# EAGLE design FIFO+Expander-v3-Rev1 (EAGLE 9.6.2)

## Sheet 1 of 3
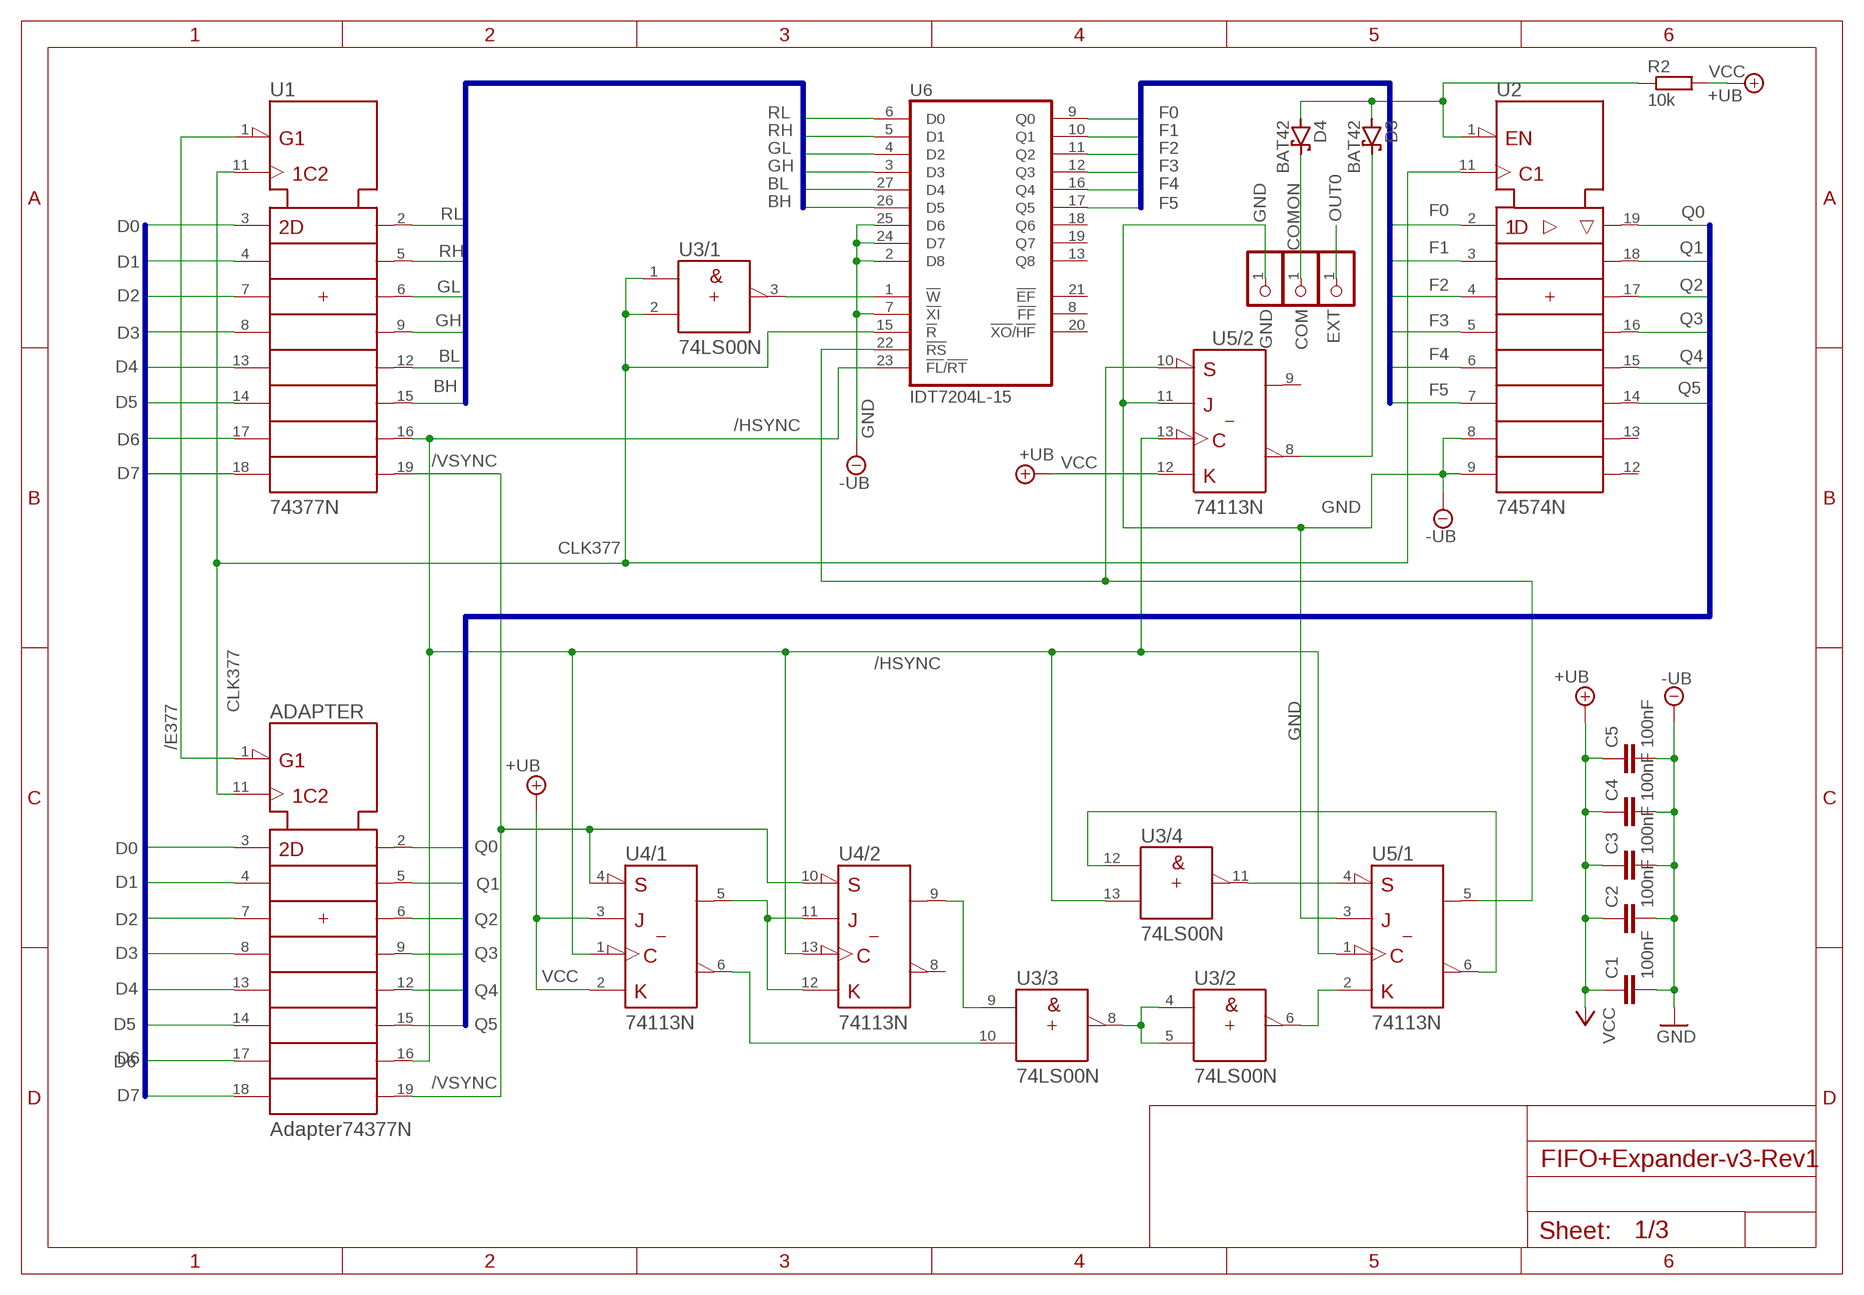
[diagram p0: schematic, sheet 1]

### Parts
ADAPTER  Adapter74377N  74377N  [DIL20]
C1  100nF  C5/2.5  [C5B2.5]
C2  100nF  C5/2.5  [C5B2.5]
C3  100nF  C5/2.5  [C5B2.5]
C4  100nF  C5/2.5  [C5B2.5]
C5  100nF  C5/2.5  [C5B2.5]
COMON  COM  PINHD-1X1  [1X01]
D3  BAT42  [DO35-10]
D4  BAT42  [DO35-10]
GND  GND  PINHD-1X1  [1X01]
OUT0  EXT  PINHD-1X1  [1X01]
R2  10k  R-EU_0207/10  [0207/10]
U1  74377N  [DIL20]
U2  74574N  [DIL20]
U3  74LS00N  [DIL14]
U4  74113N  [DIL14]
U5  74113N  [DIL14]
U6  IDT7204L-15  7203PDIL28-3  [DIL28-3]

### Nets
/E377: ADAPTER.1(!G) U1.1(!G)
/HSYNC: ADAPTER.16(7Q) U1.16(7Q) U3.13(/4:B) U4.1(/1:CLK) U4.13(/2:CLK) U5.1(/1:CLK) U5.13(/2:CLK) U6.23(!FL!/!RT)
/VSYNC: ADAPTER.19(8Q) U1.19(8Q) U4.4(/1:!PRE) U4.10(/2:!PRE)
BH: U1.15(6Q) U6.26(D5)
BL: U1.12(5Q) U6.27(D4)
CLK377: ADAPTER.11(CLK) U1.11(CLK) U2.11(CLK) U3.1(/1:A) U3.2(/1:B) U6.15(!R)
D0: ADAPTER.3(1D) U1.3(1D)
D1: ADAPTER.4(2D) U1.4(2D)
D2: ADAPTER.7(3D) U1.7(3D)
D3: ADAPTER.8(4D) U1.8(4D)
D4: ADAPTER.13(5D) U1.13(5D)
D5: ADAPTER.14(6D) U1.14(6D)
D6: ADAPTER.17(7D) U1.17(7D)
D7: ADAPTER.18(8D) U1.18(8D)
F0: U2.2(1D) U6.9(Q0)
F1: U2.3(2D) U6.10(Q1)
F2: U2.4(3D) U6.11(Q2)
F3: U2.5(4D) U6.12(Q3)
F4: U2.6(5D) U6.16(Q4)
F5: U2.7(6D) U6.17(Q5)
GH: U1.9(4Q) U6.3(D3)
GL: U1.6(3Q) U6.4(D2)
GND [power]: C1.2 C2.2 C3.2 C4.2 C5.2 GND.1 U2.8(7D) U2.9(8D) U5.3(/1:J) U5.11(/2:J) U6.2(D8) U6.7(!XI) U6.24(D7) U6.25(D6) ; supply symbol labelled -UB ; also sheet 2,3
N$1: U4.5(/1:Q) U4.11(/2:J) U4.12(/2:K)
N$2: U3.3(/1:Y) U6.1(!W)
N$3: U3.10(/3:B) U4.6(/1:!Q)
N$4: U3.9(/3:A) U4.9(/2:Q)
N$5: D3.A D4.A R2.1 U2.1(!OC)
N$6: U3.4(/2:A) U3.5(/2:B) U3.8(/3:Y)
N$7: U3.6(/2:Y) U5.2(/1:K)
N$8: U3.11(/4:Y) U5.4(/1:!PRE)
N$9: U3.12(/4:A) U5.6(/1:!Q)
N$10: COMON.1 D4.C
N$11: D3.C U5.8(/2:!Q)
N$12: U5.5(/1:Q) U5.10(/2:!PRE) U6.22(!RS)
OUT0: OUT0.1 ; also sheet 3
Q0: ADAPTER.2(1Q) U2.19(1Q)
Q1: ADAPTER.5(2Q) U2.18(2Q)
Q2: ADAPTER.6(3Q) U2.17(3Q)
Q3: ADAPTER.9(4Q) U2.16(4Q)
Q4: ADAPTER.12(5Q) U2.15(5Q)
Q5: ADAPTER.15(6Q) U2.14(6Q)
RH: U1.5(2Q) U6.5(D1)
RL: U1.2(1Q) U6.6(D0)
VCC [power]: C1.1 C2.1 C3.1 C4.1 C5.1 R2.2 U4.2(/1:K) U4.3(/1:J) U5.12(/2:K) ; supply symbol labelled +UB ; also sheet 2,3
Unconnected: U2.12(8Q) U2.13(7Q) U4.8(/2:!Q) U5.9(/2:Q) U6.8(!FF) U6.13(Q8) U6.18(Q6) U6.19(Q7) U6.20(!XO!/!HF) U6.21(!EF)

### Buses
D0,D1,D2,D3,D4,D5,D6,D7
BH,BL,GH,GL,RH,RL
F0,F1,F2,F3,F4,F5
Q0,Q1,Q2,Q3,Q4,Q5

## Sheet 2 of 3
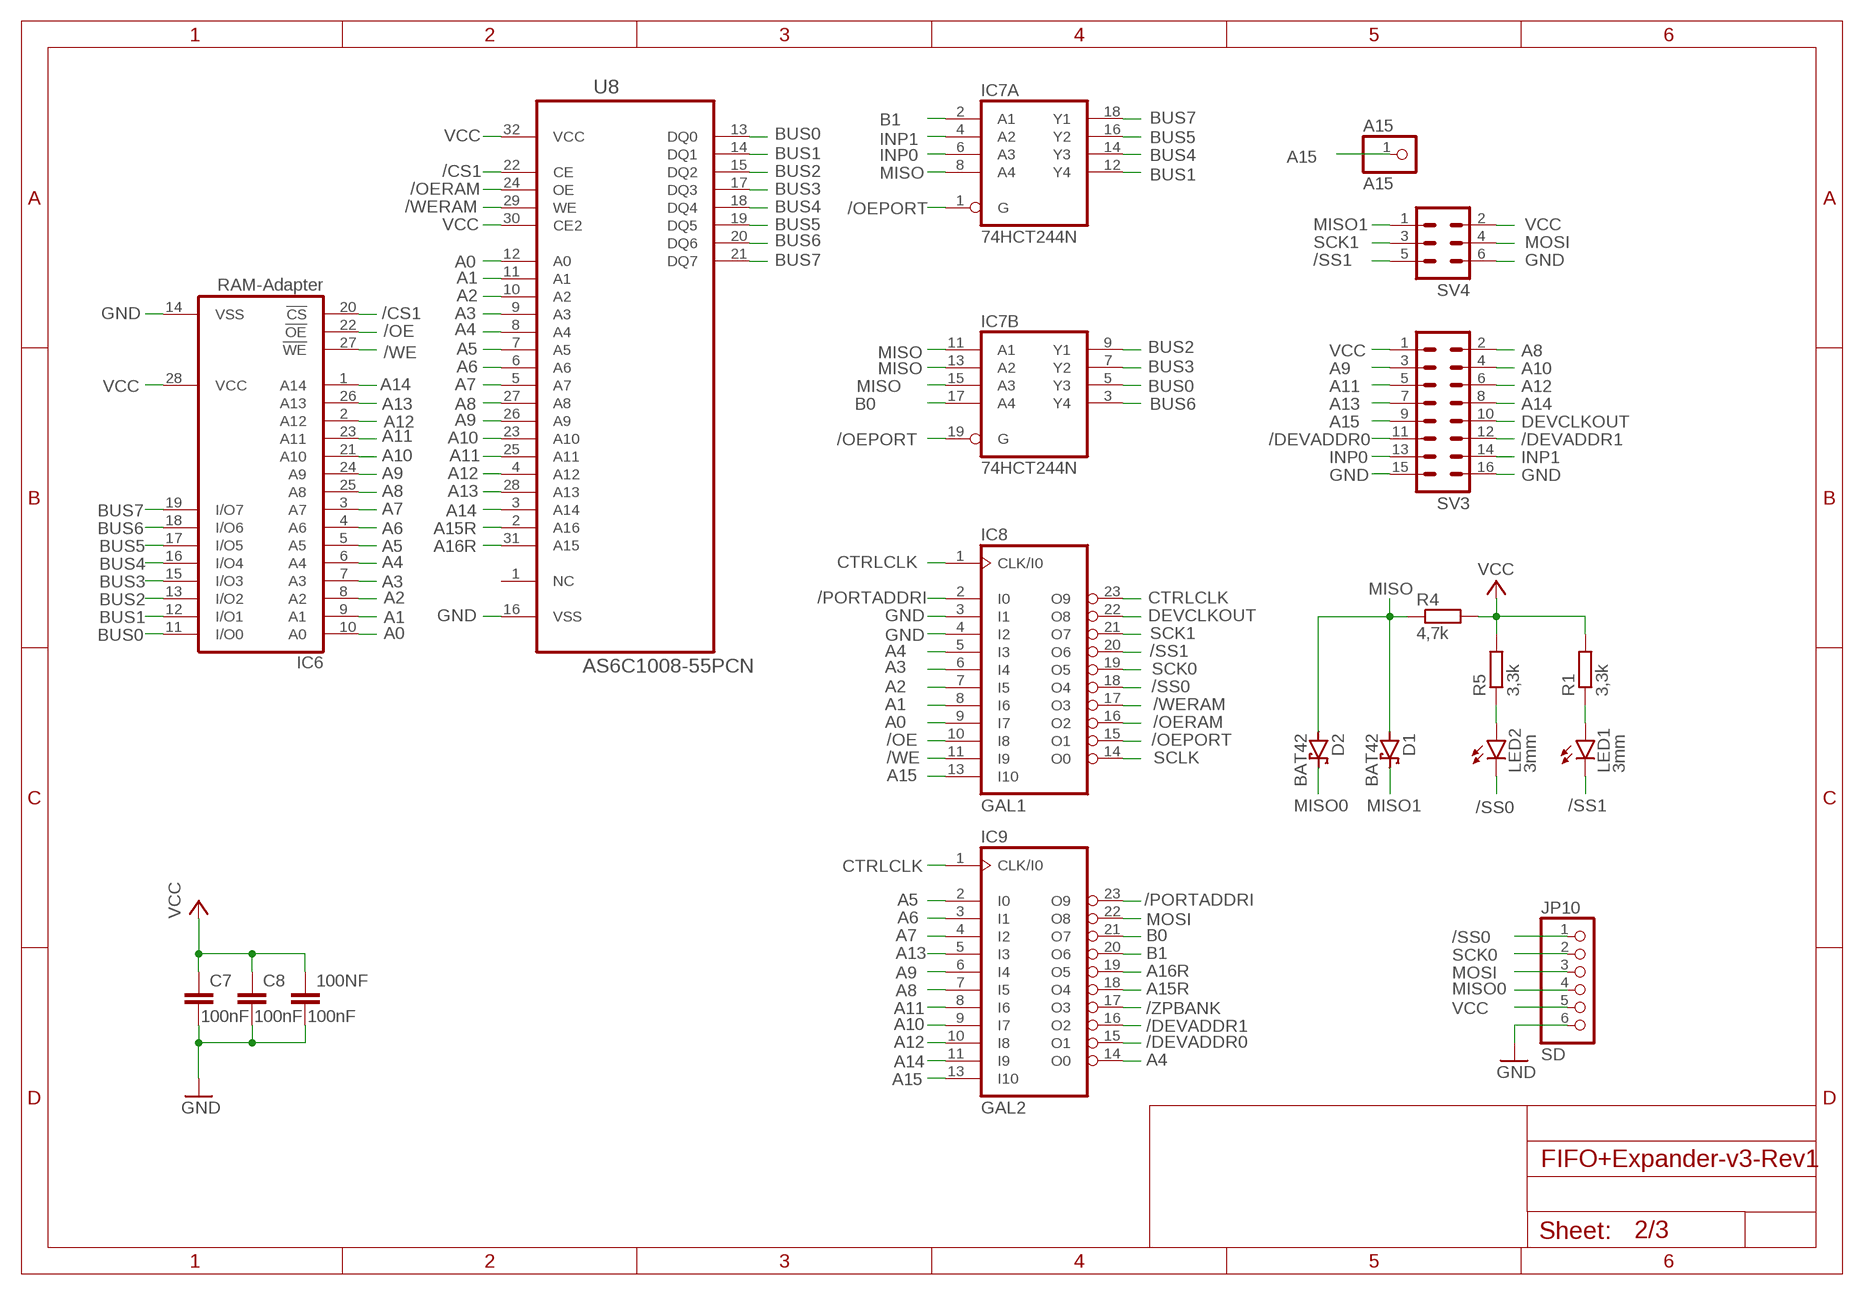
[diagram p1: schematic, sheet 2]

### Parts
100NF  100nF  C5/2.5  [C5B2.5]
A15  A15  PINHD-1X1  [1X01]
C7  100nF  C5/2.5  [C5B2.5]
C8  100nF  C5/2.5  [C5B2.5]
D1  BAT42  [DO35-10]
D2  BAT42  [DO35-10]
IC6  RAM-Adapter  62256P  [DIL28-6]
IC7  74HCT244N  [DIL20]
IC8  GAL1  22V10  [DIL24-3]
IC9  GAL2  22V10  [DIL24-3]
JP10  SD  PINHD-1X6  [1X06]
LED1  3mm  LED3MM  [LED3MM]
LED2  3mm  LED3MM  [LED3MM]
R1  3,3k  R-EU_0207/10  [0207/10]
R4  4,7k  R-EU_0207/10  [0207/10]
R5  3,3k  R-EU_0207/10  [0207/10]
SV3  ML16  [ML16]
SV4  ML6  [ML6]
U8  AS6C1008-55PCN  [DIP254P1524X393-32]

### Nets
/CS1: IC6.20(!CS) U8.22(CE)
/DEVADDR0: IC9.15(O1) SV3.11 ; also sheet 3
/DEVADDR1: IC9.16(O2) SV3.12
/OE: IC6.22(!OE) IC8.10(I8)
/OEPORT: IC7.1(A:G) IC7.19(B:G) IC8.15(O1)
/OERAM: IC8.16(O2) U8.24(OE)
/PORTADDRI: IC8.2(I0) IC9.23(O9)
/SS0: IC8.18(O4) JP10.1 LED2.K(C)
/SS1: IC8.20(O6) LED1.K(C) SV4.5
/WE: IC6.27(!WE) IC8.11(I9)
/WERAM: IC8.17(O3) U8.29(WE)
/ZPBANK: IC9.17(O3)
A0: IC6.10(A0) IC8.9(I7) U8.12(A0)
A1: IC6.9(A1) IC8.8(I6) U8.11(A1)
A2: IC6.8(A2) IC8.7(I5) U8.10(A2)
A3: IC6.7(A3) IC8.6(I4) U8.9(A3)
A4: IC6.6(A4) IC8.5(I3) IC9.14(O0) U8.8(A4)
A5: IC6.5(A5) IC9.2(I0) U8.7(A5)
A6: IC6.4(A6) IC9.3(I1) U8.6(A6)
A7: IC6.3(A7) IC9.4(I2) U8.5(A7)
A8: IC6.25(A8) IC9.7(I5) SV3.2 U8.27(A8) ; also sheet 3
A9: IC6.24(A9) IC9.6(I4) SV3.3 U8.26(A9) ; also sheet 3
A10: IC6.21(A10) IC9.9(I7) SV3.4 U8.23(A10) ; also sheet 3
A11: IC6.23(A11) IC9.8(I6) SV3.5 U8.25(A11) ; also sheet 3
A12: IC6.2(A12) IC9.10(I8) SV3.6 U8.4(A12) ; also sheet 3
A13: IC6.26(A13) IC9.5(I3) SV3.7 U8.28(A13) ; also sheet 3
A14: IC6.1(A14) IC9.11(I9) SV3.8 U8.3(A14) ; also sheet 3
A15: A15.1 IC8.13(I10) IC9.13(I10) SV3.9 ; also sheet 3
A15R: IC9.18(O4) U8.2(A16)
A16R: IC9.19(O5) U8.31(A15)
B0: IC7.17(B:A4) IC9.21(O7)
B1: IC7.2(A:A1) IC9.20(O6)
BUS0: IC6.11(I/O0) IC7.5(B:Y3) U8.13(DQ0)
BUS1: IC6.12(I/O1) IC7.12(A:Y4) U8.14(DQ1)
BUS2: IC6.13(I/O2) IC7.9(B:Y1) U8.15(DQ2)
BUS3: IC6.15(I/O3) IC7.7(B:Y2) U8.17(DQ3)
BUS4: IC6.16(I/O4) IC7.14(A:Y3) U8.18(DQ4)
BUS5: IC6.17(I/O5) IC7.16(A:Y2) U8.19(DQ5)
BUS6: IC6.18(I/O6) IC7.3(B:Y4) U8.20(DQ6)
BUS7: IC6.19(I/O7) IC7.18(A:Y1) U8.21(DQ7)
CTRLCLK: IC8.1(CLK/I0) IC8.23(O9) IC9.1(CLK/I0)
DEVCLKOUT: IC8.22(O8) SV3.10 ; also sheet 3
GND [power]: 100NF.2 C7.2 C8.2 IC6.14(VSS) IC8.3(I1) IC8.4(I2) JP10.6 SV3.15 SV3.16 SV4.6 U8.16(VSS) ; also sheet 1,3
INP0 [power]: IC7.6(A:A3) SV3.13
INP1 [power]: IC7.4(A:A2) SV3.14
MISO [power]: D1.A D2.A IC7.8(A:A4) IC7.11(B:A1) IC7.13(B:A2) IC7.15(B:A3) R4.1
MISO0: D2.C JP10.4
MISO1: D1.C SV4.1
MOSI: IC9.22(O8) JP10.3 SV4.4
N$13: LED2.A R5.1
N$14: LED1.A R1.1
SCK0: IC8.19(O5) JP10.2
SCK1: IC8.21(O7) SV4.3
SCLK: IC8.14(O0)
VCC [power]: 100NF.1 C7.1 C8.1 IC6.28(VCC) JP10.5 R1.2 R4.2 R5.2 SV3.1 SV4.2 U8.30(CE2) U8.32(VCC) ; also sheet 1,3
Unconnected: U8.1(NC)

## Sheet 3 of 3
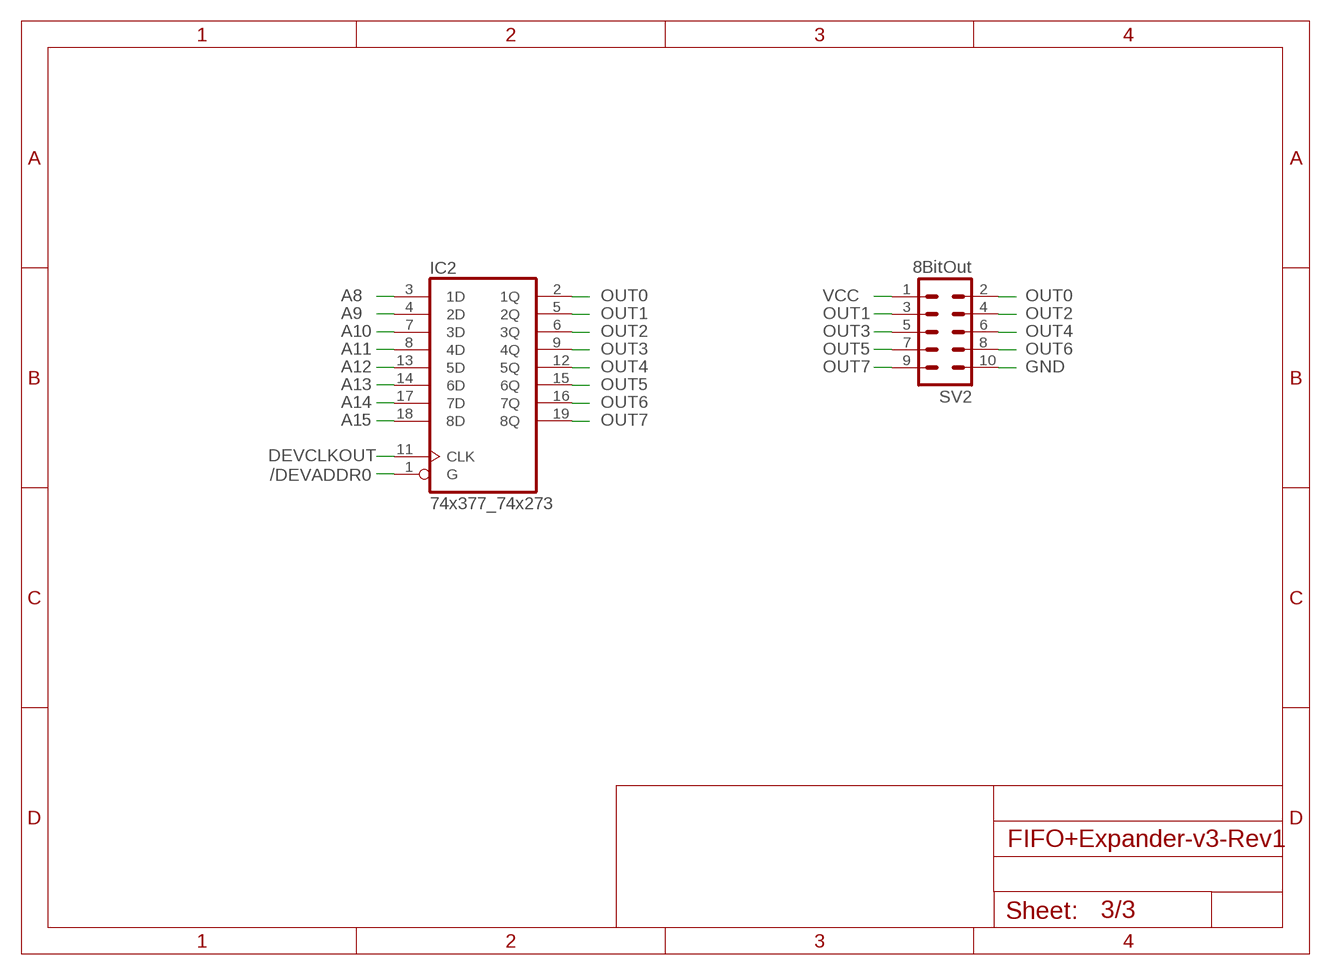
[diagram p2: schematic, sheet 3]

### Parts
IC2  74x377_74x273  74AC377N  [DIL20]
SV2  8BitOut  ML10  [ML10]

### Nets
/DEVADDR0: IC2.1(G) ; also sheet 2
A8: IC2.3(1D) ; also sheet 2
A9: IC2.4(2D) ; also sheet 2
A10: IC2.7(3D) ; also sheet 2
A11: IC2.8(4D) ; also sheet 2
A12: IC2.13(5D) ; also sheet 2
A13: IC2.14(6D) ; also sheet 2
A14: IC2.17(7D) ; also sheet 2
A15: IC2.18(8D) ; also sheet 2
DEVCLKOUT: IC2.11(CLK) ; also sheet 2
GND [power]: SV2.10 ; also sheet 1,2
OUT0: IC2.2(1Q) SV2.2 ; also sheet 1
OUT1: IC2.5(2Q) SV2.3
OUT2: IC2.6(3Q) SV2.4
OUT3: IC2.9(4Q) SV2.5
OUT4: IC2.12(5Q) SV2.6
OUT5: IC2.15(6Q) SV2.7
OUT6: IC2.16(7Q) SV2.8
OUT7: IC2.19(8Q) SV2.9
VCC [power]: SV2.1 ; also sheet 1,2

## Power pins joined to a net without a drawn wire
GND: ADAPTER.10(-UB) IC2.10(GND) IC7.10(P:GND) IC8.12(GND) IC9.12(GND) U1.10(-UB) U2.10(-UB) U3.7(/-UB:-UB) U4.7(/-UB:-UB) U5.7(/-UB:-UB) U6.14(GND)
VCC: ADAPTER.20(+UB) IC2.20(VCC) IC7.20(P:VCC) IC8.24(VCC) IC9.24(VCC) U1.20(+UB) U2.20(+UB) U3.14(/+UB:+UB) U4.14(/+UB:+UB) U5.14(/+UB:+UB) U6.28(VCC)

## Library data of the parts
100NF C1-C5 C7 C8 = capacitor-wima:C: CAPACITOR naming: grid - package width
A15 COMON GND OUT0 = pinhead:PINHD-1X1: PIN HEADER
ADAPTER U1 = 74ttl-din:74*377: Octal D type FLIP FLOP, enable
D1-D4 = diode:BAT42: DIODE barrier diode
IC2 = 74xx-eu:74*377: Octal D type FLIP FLOP, enable
IC6 = memory-hitachi:62256P: MEMORY; OC_FARNELL: unknown; OC_NEWARK: unknown
IC7 = 74xx-eu:74*244: Octal BUFFER and LINE DRIVER, 3-state
IC8 IC9 = pal:22V10: PAL; MPN: GAL22V10D-7LPN; OC_FARNELL: 1571925; OC_NEWARK: 97M0480
JP10 = pinhead:PINHD-1X6: PIN HEADER
LED1 LED2 = led:LED: LED OSRAM: - CHIPLED LG R971, LG N971, LY N971, LG Q971, LY Q971, LO R971, LY R971 LH N974, LH R974 LS Q976, LO Q976, LY Q976 LO Q996 - Hyper CHIPLED LW Q18S LB Q993, LB Q99A, LB R99A - SideLED LS A670, LO A670, LY A670, LG A670, LP A670 LB A673, LV A673, LT A673, LW A673 LH A674 LY A675 LS A676, LA A676, LO A676, LY A676, LW A676 LS A679, LY A679, LG A679 - Hyper Micro SIDELED® LS Y876, LA Y876, LO Y876, LY Y876 LT Y87S - SmartLED LW L88C, LW L88S LB L89C, LB L89S, LG L890 LS L89K, LO L89K, LY L89K LS L896, LA L896, LO L896, LY L896 - TOPLED LS T670, LO T670, LY T670, LG T670, LP T670 LSG T670, LSP T670, LSY T670, LOP T670, LYG T670 LG T671, LOG T671, LSG T671 LB T673, LV T673, LT T673, LW T673 LH T674 LS T676, LA T676, LO T676, LY T676, LB T676, LH T676, LSB T676, LW T676 LB T67C, LV T67C, LT T67C, LS T67K, LO T67K, LY T67K, LW E67C LS E67B, LA E67B, LO E67B, LY E67B, LB E67C, LV E67C, LT E67C LW T67C LS T679, LY T679, LG T679 LS T770, LO T770, LY T770, LG T770, LP T770 LB T773, LV T773, LT T773, LW T773 LH T774 LS E675, LA E675, LY E675, LS T675 LS T776, LA T776, LO T776, LY T776, LB T776 LHGB T686 LT T68C, LB T68C - Hyper Mini TOPLED® LB M676 - Mini TOPLED Santana® LG M470 LS M47K, LO M47K, LY M47K Source: http://www.osram.convergy.de LUXEON: - LUMILED® LXK2-PW12-R00, LXK2-PW12-S00, LXK2-PW14-U00, LXK2-PW14-V00 LXK2-PM12-R00, LXK2-PM12-S00, LXK2-PM14-U00 LXK2-PE12-Q00, LXK2-PE12-R00, LXK2-PE12-S00, LXK2-PE14-T00, LXK2-PE14-U00 LXK2-PB12-K00, LXK2-PB12-L00, LXK2-PB12-M00, LXK2-PB14-N00, LXK2-PB14-P00, LXK2-PB14-Q00 LXK2-PR12-L00, LXK2-PR12-M00, LXK2-PR14-Q00, LXK2-PR14-R00 LXK2-PD12-Q00, LXK2-PD12-R00, LXK2-PD12-S00 LXK2-PH12-R00, LXK2-PH12-S00 LXK2-PL12-P00, LXK2-PL12-Q00, LXK2-PL12-R00 Source: www.luxeon.com KINGBRIGHT: KA-3528ASYC Source: www.kingbright.com
R1 R2 R4 R5 = rcl:R-EU_: RESISTOR, European symbol; SPICEPREFIX: R
SV2 = con-ml:ML10: HARTING; OC_FARNELL: unknown; OC_NEWARK: unknown
SV3 = con-ml:ML16: HARTING; OC_FARNELL: unknown; OC_NEWARK: unknown
SV4 = con-ml:ML6: HARTING; OC_FARNELL: unknown; OC_NEWARK: unknown
U2 = 74ttl-din:74*574: 8-bit D type FLIP FLOP bus driver
U3 = 74ttl-din:74*00: Quad 2-input NAND gate
U4 U5 = 74ttl-din:74*113: Dual J-K negative edge triggered FLIP FLOP, preset
U6 = memory-idt:7203P: MEMORY
U8 = Alliance_Memory_By_element14_Batch_1:AS6C1008-55PCN: CMOS SRAM; MPN: AS6C1008-55PCN; OC_FARNELL: 1562896; OC_NEWARK: 94M6214; PACKAGE: DIP-32; SUPPLIER: ALLIANCE MEMORY

## Net classes
0 default: width 0.152 mm, drill 0.127 mm, clearance 0.127 mm
1 power: width 0.203 mm, drill 0.127 mm, clearance 0.127 mm

## Board
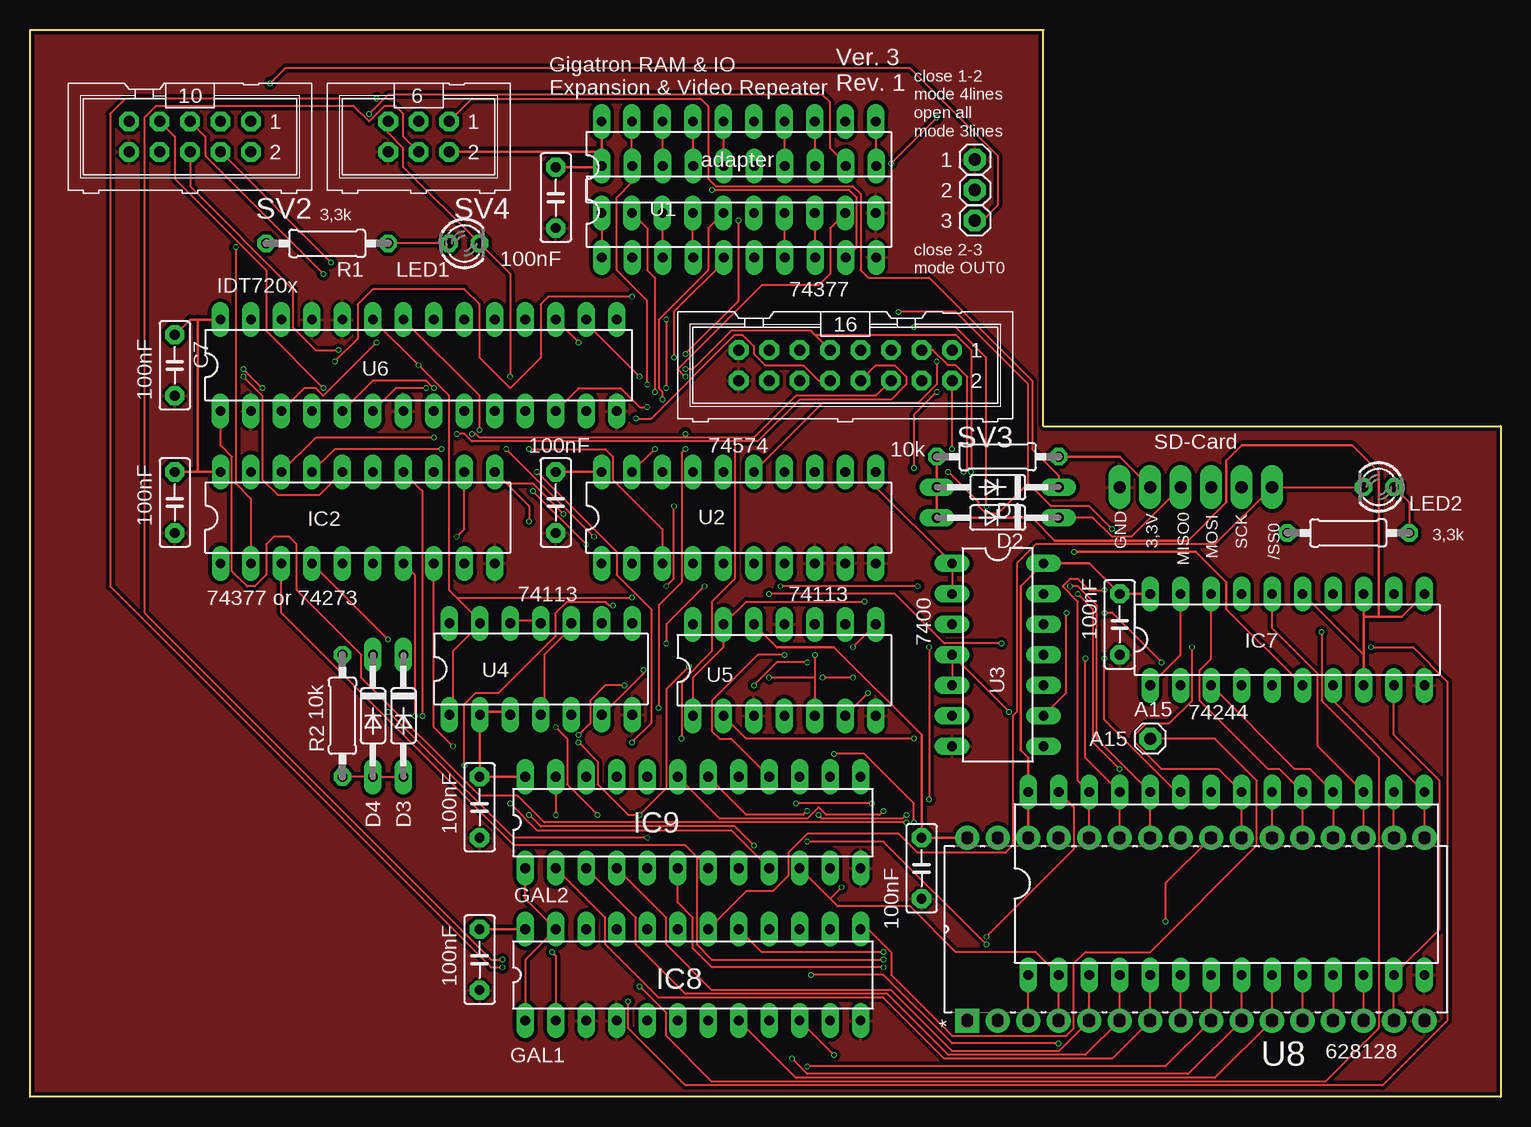
[diagram p3: board, top side]
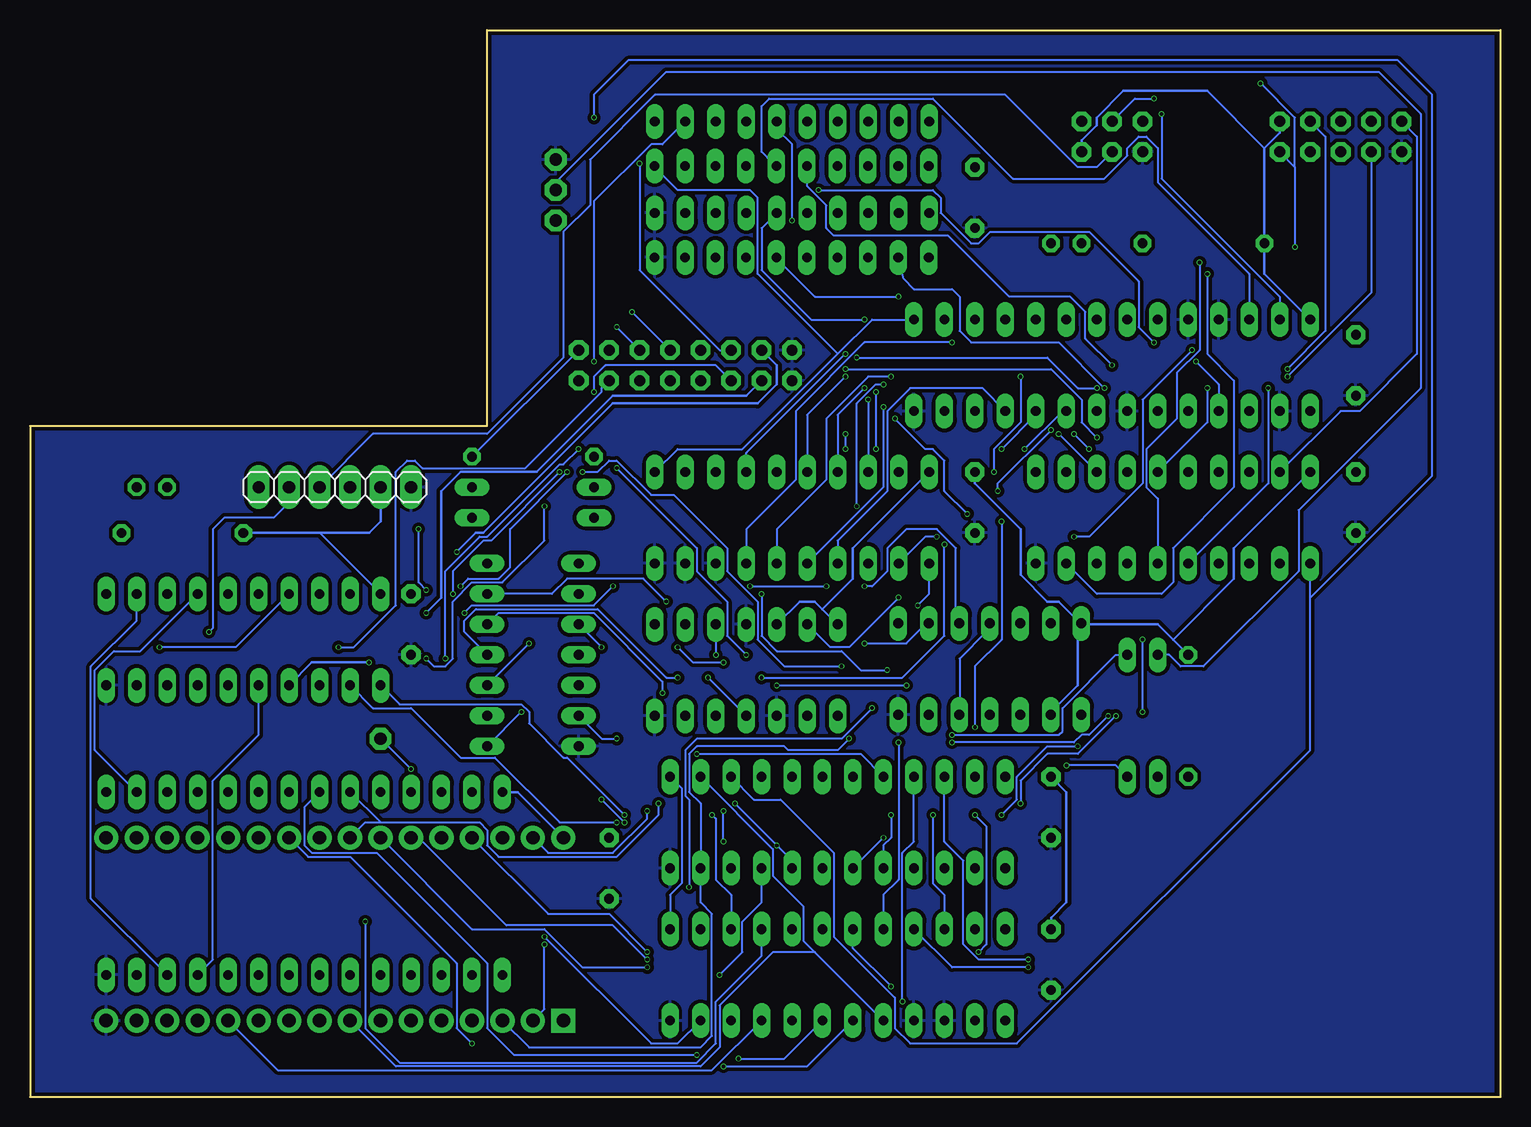
[diagram p4: board, bottom side, seen from below]

Size 122.56 x 88.9 mm. Coordinates in mm from the lower left corner, seen from the top.
Outline: 84.45,55.88 122.56,55.88 122.56,0 0,0 0,88.9 84.45,88.9 84.45,55.88
Copper layers (1*16): Top 0.035mm / dielectric 1.6mm / Bottom 0.035mm
Design rules "jlcpcb-2layers": minimum track width 5mil, minimum drill 0.3mm, track to track 5mil, track to pad 5mil, pad to pad 5mil, via to via 5mil, smd to smd 5mil, copper to edge 0.2mm, drill to drill 6mil, minimum pad ring 10mil, minimum via ring 3mil, stop-mask expansion 4mil, vias tented up to drill 0mil, thermal gap 10mil

### Footprints (pad centres in the part's own frame; a part is rotated, then mirrored left to right if it is on the bottom)
C5B2.5 = drill 0.813 pad 1.6 octagon: 1 -2.54,0; 2 2.54,0
1X01 = drill 1.016 octagon: 1 0,0
DIL20 = drill 0.813 long: 1 -11.43,-3.81; 2 -8.89,-3.81; 3 -6.35,-3.81; 4 -3.81,-3.81; 5 -1.27,-3.81; 6 1.27,-3.81; 7 3.81,-3.81; 8 6.35,-3.81; 9 8.89,-3.81; 10 11.43,-3.81; 11 11.43,3.81; 12 8.89,3.81; 13 6.35,3.81; 14 3.81,3.81; 15 1.27,3.81; 16 -1.27,3.81; 17 -3.81,3.81; 18 -6.35,3.81; 19 -8.89,3.81; 20 -11.43,3.81
DO35-10 = drill 0.813 long: A 5.08,0; C -5.08,0
DIL28-6 = drill 0.813 long: 1 -16.51,-7.62; 2 -13.97,-7.62; 3 -11.43,-7.62; 4 -8.89,-7.62; 5 -6.35,-7.62; 6 -3.81,-7.62; 7 -1.27,-7.62; 8 1.27,-7.62; 9 3.81,-7.62; 10 6.35,-7.62; 11 8.89,-7.62; 12 11.43,-7.62; 13 13.97,-7.62; 14 16.51,-7.62; 15 16.51,7.62; 16 13.97,7.62; 17 11.43,7.62; 18 8.89,7.62; 19 6.35,7.62; 20 3.81,7.62; 21 1.27,7.62; 22 -1.27,7.62; 23 -3.81,7.62; 24 -6.35,7.62; 25 -8.89,7.62; 26 -11.43,7.62; 27 -13.97,7.62; 28 -16.51,7.62
DIL24-3 = drill 0.813 long: 1 -13.97,-3.81; 2 -11.43,-3.81; 3 -8.89,-3.81; 4 -6.35,-3.81; 5 -3.81,-3.81; 6 -1.27,-3.81; 7 1.27,-3.81; 8 3.81,-3.81; 9 6.35,-3.81; 10 8.89,-3.81; 11 11.43,-3.81; 12 13.97,-3.81; 13 13.97,3.81; 14 11.43,3.81; 15 8.89,3.81; 16 6.35,3.81; 17 3.81,3.81; 18 1.27,3.81; 19 -1.27,3.81; 20 -3.81,3.81; 21 -6.35,3.81; 22 -8.89,3.81; 23 -11.43,3.81; 24 -13.97,3.81
1X06 = drill 1.016 long: 1 -6.35,0; 2 -3.81,0; 3 -1.27,0; 4 1.27,0; 5 3.81,0; 6 6.35,0
LED3MM = drill 0.813 octagon: A -1.27,0; K 1.27,0
0207/10 = drill 0.813 octagon: 1 -5.08,0; 2 5.08,0
ML10 = drill 0.914 octagon: 1 -5.08,-1.27; 2 -5.08,1.27; 3 -2.54,-1.27; 4 -2.54,1.27; 5 0,-1.27; 6 0,1.27; 7 2.54,-1.27; 8 2.54,1.27; 9 5.08,-1.27; 10 5.08,1.27
ML16 = drill 0.914 octagon: 1 -8.89,-1.27; 2 -8.89,1.27; 3 -6.35,-1.27; 4 -6.35,1.27; 5 -3.81,-1.27; 6 -3.81,1.27; 7 -1.27,-1.27; 8 -1.27,1.27; 9 1.27,-1.27; 10 1.27,1.27; 11 3.81,-1.27; 12 3.81,1.27; 13 6.35,-1.27; 14 6.35,1.27; 15 8.89,-1.27; 16 8.89,1.27
ML6 = drill 0.914 octagon: 1 -2.54,-1.27; 2 -2.54,1.27; 3 0,-1.27; 4 0,1.27; 5 2.54,-1.27; 6 2.54,1.27
DIL14 = drill 0.813 long: 1 -7.62,-3.81; 2 -5.08,-3.81; 3 -2.54,-3.81; 4 0,-3.81; 5 2.54,-3.81; 6 5.08,-3.81; 7 7.62,-3.81; 8 7.62,3.81; 9 5.08,3.81; 10 2.54,3.81; 11 0,3.81; 12 -2.54,3.81; 13 -5.08,3.81; 14 -7.62,3.81
DIL28-3 = drill 0.813 long: 1 -16.51,-3.81; 2 -13.97,-3.81; 3 -11.43,-3.81; 4 -8.89,-3.81; 5 -6.35,-3.81; 6 -3.81,-3.81; 7 -1.27,-3.81; 8 1.27,-3.81; 9 3.81,-3.81; 10 6.35,-3.81; 11 8.89,-3.81; 12 11.43,-3.81; 13 13.97,-3.81; 14 16.51,-3.81; 15 16.51,3.81; 16 13.97,3.81; 17 11.43,3.81; 18 8.89,3.81; 19 6.35,3.81; 20 3.81,3.81; 21 1.27,3.81; 22 -1.27,3.81; 23 -3.81,3.81; 24 -6.35,3.81; 25 -8.89,3.81; 26 -11.43,3.81; 27 -13.97,3.81; 28 -16.51,3.81
DIP254P1524X393-32 = drill 1.118 square: 1 -15.24,38.1 | drill 1.118: 2 -15.24,35.56; 3 -15.24,33.02; 4 -15.24,30.48; 5 -15.24,27.94; 6 -15.24,25.4; 7 -15.24,22.86; 8 -15.24,20.32; 9 -15.24,17.78; 10 -15.24,15.24; 11 -15.24,12.7; 12 -15.24,10.16; 13 -15.24,7.62; 14 -15.24,5.08; 15 -15.24,2.54; 16 -15.24,0; 17 0,0; 18 0,2.54; 19 0,5.08; 20 0,7.62; 21 0,10.16; 22 0,12.7; 23 0,15.24; 24 0,17.78; 25 0,20.32; 26 0,22.86; 27 0,25.4; 28 0,27.94; 29 0,30.48; 30 0,33.02; 31 0,35.56; 32 0,38.1

### Placement (x,y rotation side)
100NF  37.46,11.43 270 top
A15  93.34,29.84 0 top
ADAPTER  59.06,77.47 0 top
C1  43.81,49.53 270 top
C2  12.06,49.53 270 top
C3  90.81,39.37 270 top
C4  74.29,19.05 270 top
C5  43.81,74.93 270 top
C7  12.06,60.96 270 top
C8  37.46,24.13 270 top
COMON  78.74,75.56 0 top
D1  80.64,50.8 180 top
D2  80.64,48.26 180 top
D3  31.11,31.75 270 top
D4  28.57,31.75 270 top
GND  78.74,78.1 0 top
IC2  27.3,48.26 0 top
IC6  99.69,17.78 0 top
IC7  104.78,38.1 0 top
IC8  55.25,10.16 0 top
IC9  55.25,22.86 0 top
JP10  97.16,50.8 0 bottom
LED1  36.19,71.12 0 top
LED2  112.39,50.8 180 top
OUT0  78.74,73.02 0 top
R1  24.77,71.12 180 top
R2  26.03,31.75 90 top
R4  80.64,53.34 0 top
R5  109.85,46.99 180 top
SV2  13.33,80.01 180 top
SV3  67.94,60.96 180 top
SV4  32.38,80.01 180 top
U1  59.08,73.76 0 top
U2  59.06,48.26 0 top
U3  80.64,36.83 270 top
U4  42.57,35.65 0 top
U5  62.86,35.56 0 top
U6  32.38,60.96 0 top
U8  116.2,21.59 90 top

### Tracks (layer width: path | path; a pad name or v marks a point on that pad's centre or on a via)
/CS1
  Top 0.152: U8.22 IC6.20
/DEVADDR0  (via drill 0.3)
  Top 0.152: v75.56,81.6 v71.75,77.79
  Bottom 0.152: 15.88,41.59 15.88,28.89 40.32,4.44 49.21,4.44 50.48,5.71 50.48,8.25 55.56,13.33 55.56,20.32 60.01,24.77 62.23,24.77 IC9.15 | 15.88,41.59 IC2.1 | SV3.11 65.09,62.23 71.75,68.9 v71.75,77.79 | v75.56,81.6 75.56,83.5 72.71,86.36 8.57,86.36 5.71,83.5 5.71,51.75 15.88,41.59
/DEVADDR1  (via drill 0.3)
  Top 0.152: IC9.16 58.42,29.84 57.47,29.84 56.83,30.48 56.83,33.02 60.64,36.83 v62.86,36.83 | v73.66,52.39 73.66,56.83 v75.56,58.74
  Bottom 0.152: v62.86,36.83 64.45,38.42 64.45,41.27 66.99,43.81 66.99,45.72 v73.66,52.39 | v75.56,58.74 75.56,60.01 74.61,60.96 65.41,60.96 SV3.12
/E377
  Top 0.152: ADAPTER.1 47.62,70.17 U1.1
/HSYNC  (via drill 0.3)
  Top 0.152: U5.1 55.25,34.92 57.78,37.47 U5.13 59.69,41.27 v69.53,41.27 | ADAPTER.16 57.78,77.79 U1.16 | U4.1 35.24,32.07 35.24,37.15 37.46,39.37 U4.13 37.46,39.69 35.56,41.59 | U6.23 v32.38,60.96 34.92,58.42 34.92,42.23 35.56,41.59 | 35.56,41.59 v50.16,41.59
  Bottom 0.152: U3.13 79.06,41.91 77.79,43.18 71.44,43.18 v69.53,41.27 | v32.38,60.96 34.61,63.18 34.61,65.41 35.88,66.67 40.96,66.67 46.04,71.75 55.56,71.75 56.2,72.39 56.2,74.3 57.78,75.88 57.78,77.47 U1.16 | U5.13 55.88,37.47 54.29,37.47 v50.16,41.59
/OE  (via drill 0.3)
  Top 0.152: v66.99,3.49 IC8.10
  Bottom 0.152: v66.99,3.49 82.23,3.49 84.45,5.71 84.45,11.11 93.66,20.32 99.06,20.32 99.69,20.95 99.69,24.13 IC6.22
/OEPORT  (via drill 0.3)
  Top 0.152: v65.72,23.49 66.04,23.18 72.71,23.18 v73.03,23.49 | IC7.19 95.88,36.83 IC7.1
  Bottom 0.152: IC8.15 64.13,16.83 65.41,18.1 65.41,23.18 v65.72,23.49 | v73.03,23.49 77.79,28.26 78.1,28.26 80.96,31.11 80.96,32.07 81.6,32.7 91.76,32.7 IC7.1
/OERAM  (via drill 0.3)
  Top 0.152: v94.61,14.6 94.61,17.78 U8.24
  Bottom 0.152: IC8.16 61.59,11.75 65.41,7.94 65.41,4.44 66.99,2.86 91.76,2.86 94.61,5.71 v94.61,14.6
/PORTADDRI  (via drill 0.3)
  Top 0.152: IC8.2 43.81,11.75 v43.5,12.06 | IC9.23 v43.81,23.49
  Bottom 0.152: v43.5,12.06 42.86,12.7 42.86,22.54 v43.81,23.49
/SS0
  Top 0.152: IC8.18 59.69,17.14 61.91,17.14 63.18,18.41 63.18,20.32 64.77,21.91 72.39,21.91 73.98,20.32 81.28,20.32 81.91,20.95 81.91,31.75 82.23,32.07 82.23,44.45 83.82,46.04 98.74,46.04 JP10.1 LED2.K
/SS1  (via drill 0.3)
  Top 0.152: v50.16,29.53 51.75,31.11 51.75,40.64 48.89,43.5 48.89,45.4 v42.23,52.07 | v40,60.01 40,68.58 LED1.K 31.11,77.47 31.11,79.06 29.84,80.33 SV4.5
  Bottom 0.152: IC8.20 51.43,16.83 50.16,18.1 v50.16,29.53 | v42.23,52.07 42.23,53.97 40,56.2 v40,60.01
/VSYNC  (via drill 0.3)
  Top 0.152: ADAPTER.19 50.16,77.79 U1.19 50.16,77.47 50.16,76.2 48.89,74.93 48.89,68.9 51.43,66.36 v51.43,59.37 | U4.4 42.86,32.07 42.86,36.83 45.4,39.37 U4.10 | v53.66,49.21 53.66,43.18 v53.02,42.55
  Bottom 0.152: v51.43,59.37 52.07,59.37 53.66,57.78 v53.66,49.21 | v53.02,42.55 52.39,42.55 51.12,43.81 51.12,45.72 49.53,47.31 46.99,47.31 45.4,45.72 45.4,39.69 U4.10
/WE  (via drill 0.3)
  Top 0.152: v79.69,13.33 87,20.64 87,24.13 IC6.27
  Bottom 0.152: IC8.11 68.58,4.44 70.8,4.44 v79.69,13.33
/WERAM  (via drill 0.3)
  Top 0.152: IC8.17 60.96,12.06 v71.12,12.06
  Bottom 0.152: v71.12,12.06 74.29,15.24 79.38,15.24 U8.29
A0
  Top 0.152: U8.12 IC6.10
  Bottom 0.152: IC8.9 65.72,2.22 101.92,2.22 U8.12
A1
  Top 0.152: IC8.8 63.82,1.59 98.74,1.59 U8.11 IC6.9
A2  (via drill 0.3)
  Top 0.152: v63.5,3.17 64.77,1.9 96.52,1.9 U8.10 IC6.8
  Bottom 0.152: IC8.7 59.69,3.17 v63.5,3.17
A3  (via drill 0.3)
  Top 0.152: v64.77,2.54 94.61,2.54 U8.9 IC6.7
  Bottom 0.152: IC8.6 57.78,2.54 v64.77,2.54
A4
  Top 0.152: U8.8 IC6.6
  Bottom 0.152: 57.15,12.06 58.1,13.02 58.1,15.88 60.64,18.41 60.64,20.64 IC9.14 | 57.15,12.06 IC8.5 | U8.8 92.07,2.54 66.67,2.54 65.09,4.13 65.09,7.62 60.64,12.06 57.15,12.06
A5
  Top 0.152: IC9.2 47.94,14.92 47.94,12.7 52.39,8.25 71.12,8.25 76.2,3.17 90.17,3.17 U8.7 IC6.5
A6
  Top 0.152: IC9.3 50.48,14.92 50.48,12.7 54.61,8.57 71.44,8.57 76.52,3.49 87.95,3.49 U8.6 IC6.4
A7
  Top 0.152: IC9.4 53.02,14.92 53.02,12.7 56.83,8.89 71.75,8.89 76.84,3.81 85.72,3.81 U8.5 IC6.3
A8  (via drill 0.3)
  Top 0.152: U8.27 IC6.25 87.95,28.26 v87.95,36.51 | v76.84,53.97 SV3.2 | IC2.3 20.95,40.32 40.32,20.95 54.61,20.95 55.56,20 | IC9.7 55.56,20 | v71.12,11.43 56.83,11.43 55.56,12.7 55.56,20
  Bottom 0.152: v76.84,53.97 78.1,52.7 78.42,52.7 84.45,46.67 85.09,46.67 87.95,43.81 v87.95,36.51 | U8.27 90.17,21.59 82.87,14.29 73.98,14.29 v71.12,11.43
A9  (via drill 0.3)
  Top 0.152: IC9.6 53.97,16.19 55.25,14.92 55.25,12.38 56.83,10.8 v71.12,10.8 | U8.26 IC6.24 88.9,29.84 88.9,40.96 87.31,42.55 v86.68,42.55 | v29.84,38.1 IC2.4 | v29.84,32.07 40.32,21.59 v51.43,21.59 | SV3.3 75.25,62.23 76.52,60.96 77.15,60.96 78.1,60.01 78.1,52.39 v77.79,52.07
  Bottom 0.152: v71.12,10.8 76.52,10.8 79.69,13.97 85.72,13.97 U8.26 | v29.84,32.07 v29.84,38.1 | IC9.6 v51.43,21.59 | v77.79,52.07 82.55,47.31 82.55,44.13 83.5,43.18 86.04,43.18 v86.68,42.55
A10  (via drill 0.3)
  Top 0.152: IC9.9 58.42,22.22 42.23,22.22 v40,24.45 | v32.07,31.75 32.07,43.5 IC2.7 | U8.23 IC6.21 99.06,27.3 94.3,27.3 92.07,29.53 92.07,30.16 93.03,31.11 94.93,31.11 96.84,33.02 v96.84,37.47 | v65.09,10.16 71.12,10.16 76.84,4.44 v85.72,4.44
  Bottom 0.152: v40,24.45 40,26.35 37.78,28.58 35.24,28.58 v32.07,31.75 | SV3.4 74.93,59.05 74.93,58.74 81.28,52.39 89.85,52.39 90.49,53.02 91.12,53.02 92.07,52.07 92.07,40.96 95.57,37.47 v96.84,37.47 | IC9.9 61.59,16.19 63.18,14.6 63.18,12.06 v65.09,10.16 | v85.72,4.44 87,5.71 87,11.11 95.88,20 99.38,20 U8.23
A11  (via drill 0.3)
  Top 0.152: v70.17,24.45 v63.82,24.45 | IC2.8 33.66,30.8 v35.24,29.21 | v41.59,23.49 42.54,22.54 58.74,22.54 v60.32,20.95 | v73.66,64.13 77.15,64.13 79.69,61.59 v79.69,49.21 | v89.53,36.51 89.53,31.43 95.57,25.4 IC6.23
  Bottom 0.152: IC9.8 59.06,19.69 v60.32,20.95 v63.82,24.45 | v70.17,24.45 70.17,23.49 73.66,20 83.5,20 84.45,20.95 84.45,22.22 85.09,22.86 93.34,22.86 | 93.34,22.86 94.61,22.86 U8.25 | 93.34,22.86 IC6.23 | v35.24,29.21 37.78,29.21 40.32,26.67 40.32,24.77 v41.59,23.49 | v73.66,64.13 SV3.5 | v79.69,49.21 79.69,46.35 83.19,42.86 85.72,42.86 87.31,41.27 87.31,36.51 87.95,35.88 88.9,35.88 v89.53,36.51
A12  (via drill 0.3)
  Top 0.152: U8.4 IC6.2 83.82,12.06 77.15,12.06 73.34,15.88 67.31,15.88 66.67,16.51 | 66.67,16.51 IC9.10 | v36.83,55.24 37.15,55.24 37.46,54.93 54.61,54.93 | 54.61,54.93 60.32,54.93 63.82,58.42 70.48,58.42 SV3.6 | v67.63,17.46 66.67,16.51 | v52.39,32.38 52.39,40.96 54.29,42.86 54.29,53.66 v54.61,53.97 | 54.61,54.93 v54.61,55.24
  Bottom 0.152: v36.83,55.24 IC2.13 | v67.63,17.46 67.63,24.77 67.94,25.08 67.94,28.89 66.99,29.84 54.93,29.84 v52.39,32.38 | v54.61,55.24 v54.61,53.97
A13  (via drill 0.3)
  Top 0.152: v45.72,29.53 47.31,27.94 47.31,26.03 49.85,23.49 v50.8,23.49 53.02,25.72 53.02,33.97 v54.93,35.88 | v32.7,31.75 32.7,50.48 IC2.14 | U8.28 IC6.26 87.31,26.35 87.31,41.27 86.04,42.55 86.68,43.18 87.31,43.18 88.26,42.23 v89.53,42.23 | v72.39,65.41 77.15,65.41 83.19,59.37 83.19,51.12 | 83.19,51.12 85.09,49.21 88.26,49.21 v90.17,47.31 | v76.52,52.07 79.06,49.53 79.06,49.21 79.69,48.58 80.64,48.58 83.19,51.12
  Bottom 0.152: IC9.5 51.43,20.95 50.8,21.59 v50.8,23.49 | v45.72,29.53 35.56,29.53 34.92,30.16 34.29,30.16 v32.7,31.75 | v72.39,65.41 SV3.7 | v90.17,47.31 90.17,42.86 v89.53,42.23 | v54.93,35.88 59.69,35.88 61.91,38.1 61.91,41.27 64.45,43.81 64.45,45.72 68.9,50.16 70.8,50.16 73.66,53.02 74.29,53.02 75.25,52.07 v76.52,52.07
A14  (via drill 0.3)
  Top 0.152: U8.3 IC6.1 | IC2.17 25.4,53.97 v34.29,53.97 | v35.56,55.24 36.19,55.24 36.83,54.61 58.74,54.61 | 58.74,54.61 60.64,54.61 64.13,58.1 71.75,58.1 73.03,59.37 73.03,60.01 72.07,60.96 70.48,60.96 SV3.8 | v54.29,29.84 54.29,34.61 56.83,37.15 56.83,41.27 58.74,43.18 58.74,54.61
  Bottom 0.152: U8.3 80.96,4.13 66.67,4.13 65.72,5.08 65.72,15.24 66.67,16.19 IC9.11 66.67,24.45 67.63,25.4 67.63,28.58 66.99,29.21 59.69,29.21 59.37,28.89 55.25,28.89 v54.29,29.84 | v35.56,55.24 v34.29,53.97
A15  (via drill 0.3)
  Top 0.152: A15.1 98.74,29.84 102.23,26.35 102.23,20.95 93.34,12.06 87.95,12.06 87,11.11 87,5.71 86.36,5.08 76.84,5.08 71.75,10.16 71.75,12.06 69.85,13.97 IC8.13 | IC2.18 23.81,54.93 v33.66,54.93 | v54.61,60.64 55.25,60.64 58.42,63.82 65.09,63.82 65.41,63.5 | SV3.9 65.41,63.5 | v90.81,27.3 88.58,29.53 88.58,40.64 v87.31,41.91 | v78.42,52.07 78.42,62.23 77.15,63.5 65.41,63.5
  Bottom 0.152: IC8.13 69.22,16.83 68.26,17.78 68.26,25.72 IC9.13 | v33.66,54.93 34.92,56.2 34.92,58.1 37.46,60.64 v54.61,60.64 | v90.81,27.3 A15.1 | v87.31,41.91 87.31,43.81 84.77,46.35 84.14,46.35 v78.42,52.07
A15R  (via drill 0.3)
  Top 0.152: IC9.18 59.69,23.49 64.45,23.49 v64.77,23.81 | v64.77,21.27 71.12,21.27 v79.69,12.7
  Bottom 0.152: v64.77,21.27 v64.77,23.81 | v79.69,12.7 79.69,7.3 U8.2
A16R  (via drill 0.3)
  Top 0.152: IC9.19 57.47,23.18 64.77,23.18 65.72,24.13 66.36,23.49 70.8,23.49 v71.12,23.81
  Bottom 0.152: v71.12,23.81 71.12,23.18 73.98,20.32 79.38,20.32 U8.31
B0  (via drill 0.3)
  Top 0.152: v49.85,7.94 49.85,5.71 54.61,0.95 112.71,0.95 118.11,6.35 118.11,34.61 115.25,37.47 v111.76,37.47
  Bottom 0.152: IC9.21 48.89,21.27 49.85,20.32 v49.85,7.94 | v111.76,37.47 105.41,37.47 IC7.17
B1  (via drill 0.3)
  Top 0.152: v66.99,28.58 69.53,28.58 73.66,24.45 v73.66,22.86
  Bottom 0.152: IC9.20 53.34,28.58 v66.99,28.58 | v73.66,22.86 78.42,22.86 83.82,28.26 86.68,28.26 90.81,32.38 93.98,32.38 IC7.2
BH
  Bottom 0.152: U6.26 20.95,68.58 28.57,76.2 28.57,79.06 29.53,80.01 30.16,80.01 31.11,79.06 31.11,78.42 33.02,76.52 40.64,76.52 47.31,83.19 60.96,83.19 61.59,82.55 61.59,78.74 60.64,77.79 U1.15
BL  (via drill 0.3)
  Top 0.152: v28.26,81.91 29.84,83.5 66.04,83.5 66.67,82.87 66.67,79.06 67.94,77.79 U1.12
  Bottom 0.152: U6.27 18.41,66.67 28.26,76.52 v28.26,81.91
BUS0
  Top 0.152: IC6.11 U8.13
  Bottom 0.152: IC7.5 103.5,30.16 107.31,26.35 107.31,11.43 IC6.11
BUS1
  Top 0.152: U8.14 IC6.12
  Bottom 0.152: IC7.12 113.66,39.69 117.47,35.88 117.47,16.51 IC6.12
BUS2
  Top 0.152: U8.15 IC6.13 117.47,13.97 117.47,26.35 113.66,30.16 IC7.9
BUS3
  Top 0.152: IC7.7 108.59,33.02 IC6.15 U8.17
BUS4
  Top 0.152: U8.18 IC6.16
  Bottom 0.152: IC7.14 113.35,37.15 115.57,37.15 117.16,35.56 117.16,28.89 IC6.16
BUS5
  Top 0.152: U8.19 IC6.17 107.31,29.21 107.31,35.24 103.5,39.05 IC7.16
BUS6
  Top 0.152: IC7.3 105.41,27.3 106.68,27.3 IC6.18 U8.20
BUS7
  Top 0.152: U8.21 IC6.19 104.14,27.3 103.19,27.3 97.47,33.02 97.47,35.56 98.42,36.51 IC7.18
CLK377
  Top 0.152: ADAPTER.11 70.48,77.79 U1.11 | U3.2 U3.1 70.48,50.8 U2.11
  Bottom 0.152: U6.15 52.39,64.77 55.25,61.91 | 55.25,61.91 63.18,53.97 68.58,53.97 U2.11 | 55.25,61.91 61.91,68.58 61.91,74.93 62.55,75.56 68.58,75.56 70.48,77.47 U1.11
CTRLCLK
  Top 0.152: IC8.1 41.27,11.43 IC8.23 41.27,16.51 IC9.1
D0
  Top 0.152: ADAPTER.3 52.7,70.17 U1.3
D1
  Top 0.152: ADAPTER.4 55.25,70.17 U1.4
D2
  Top 0.152: ADAPTER.7 62.86,70.17 U1.7
D3
  Top 0.152: ADAPTER.8 65.41,70.17 U1.8
D4
  Top 0.152: ADAPTER.13 65.41,77.79 U1.13
D5
  Top 0.152: ADAPTER.14 62.86,77.79 U1.14
D6
  Top 0.152: ADAPTER.17 55.25,77.79 U1.17
D7
  Top 0.152: ADAPTER.18 52.7,77.79 U1.18
DEVCLKOUT  (via drill 0.3)
  Top 0.152: v47.31,23.49 44.77,26.03 44.77,29.84 v43.81,30.8 | v41.59,47.94 41.59,49.21 39.69,51.12 | IC2.11 39.69,51.12 | SV3.10 65.72,59.69 64.45,60.96 61.28,60.96 60.32,61.91 60.32,62.55 59.37,63.5 58.74,63.5 51.75,56.52 v50.48,56.52 | v44.45,48.58 41.91,51.12 39.69,51.12
  Bottom 0.152: IC8.22 46.35,16.83 47.31,17.78 v47.31,23.49 | v43.81,30.8 43.81,35.88 41.59,38.1 v41.59,47.94 | v50.48,56.52 47.94,53.97 47.31,53.97 46.35,53.02 46.35,50.48 v44.45,48.58
F0  (via drill 0.3)
  Top 0.152: v39.69,53.97 v46.99,46.67
  Bottom 0.152: U2.2 47.94,46.67 v46.99,46.67 | v39.69,53.97 36.51,57.15 U6.9
F1  (via drill 0.3)
  Top 0.152: U2.3 52.7,47.31 48.58,51.44 48.58,53.34 47.94,53.97 v41.59,53.97
  Bottom 0.152: v41.59,53.97 38.73,56.83 U6.10
F2
  Bottom 0.152: U2.4 55.25,46.35 51.12,50.48 51.12,57.15 49.21,59.05 43.18,59.05 U6.11
F3  (via drill 0.3)
  Top 0.152: v51.43,57.47 50.8,57.47 49.21,59.05 45.72,59.05 U6.12
  Bottom 0.152: U2.5 51.43,50.8 v51.43,57.47
F4  (via drill 0.3)
  Top 0.152: v50.8,60.01 46.35,64.45 U6.16
  Bottom 0.152: U2.6 60.32,47.31 56.2,51.44 56.2,56.52 52.7,60.01 v50.8,60.01
F5  (via drill 0.3)
  Top 0.152: U6.17 v45.72,62.86
  Bottom 0.152: U2.7 62.86,47.31 58.74,51.44 58.74,57.15 53.02,62.86 v45.72,62.86
GH  (via drill 0.3)
  Top 0.152: U6.3 22.86,59.05 23.81,59.05 24.45,58.42 v28.89,62.86 | v56.83,75.56 68.26,75.56 68.9,74.93 68.9,70.8 68.26,70.17 U1.9
  Bottom 0.152: v28.89,62.86 30.16,64.13 30.16,67.94 34.29,72.07 42.54,72.07 43.5,71.12 44.13,71.12 46.67,73.66 46.67,74.93 47.31,75.56 v56.83,75.56
GL  (via drill 0.3)
  Top 0.152: v25.4,61.28 27.3,63.18 27.3,66.04 28.57,67.31 36.19,67.31 37.46,66.04 37.46,61.59 40,59.05 42.54,61.59 42.54,66.04 43.18,66.67 v50.16,66.67
  Bottom 0.152: U6.4 23.49,59.37 v25.4,61.28 | v50.16,66.67 57.15,66.67 60.32,69.85 U1.6
GND
  pour Bottom (isolate 0.305): 0.63,88.9 0.63,0 122.56,0 122.56,88.9
  pour Top (isolate 0.305): 122.56,55.88 122.56,0 -0.64,0 -0.64,88.9 89.53,88.9
INP0  (via drill 0.3)
  Top 0.203: IC7.6 99.69,40.64 99.69,42.86 97.16,45.4 v87,45.4
  Bottom 0.203: v87,45.4 85.41,46.99 84.77,46.99 73.98,57.78 61.91,57.78 60.32,59.37 60.32,60.96 SV3.13
INP1  (via drill 0.3)
  Top 0.203: v94.3,36.19 90.17,40.32 v89.53,40.32
  Bottom 0.203: IC7.4 99.06,36.19 v94.3,36.19 | v89.53,40.32 88.26,41.59 88.26,50.48 86.68,52.07 80.33,52.07 73.98,58.42 62.86,58.42 SV3.14
MISO
  Top 0.203: R4.1 D1.A D2.A 83.5,48.26 85.41,46.35 96.52,46.35 99.69,49.53 99.69,53.02 100.97,54.29 110.17,54.29 112.39,52.07 112.39,40 | IC7.13 111.12,40 | 111.12,40 111.12,36.83 | 111.12,36.83 IC7.8 | 111.12,36.83 IC7.15 | IC7.11 114.3,40 112.39,40 | 111.12,40 112.39,40
MISO0
  Top 0.152: D2.C 88.58,48.26 90.17,46.67 91.76,46.67 JP10.4
MISO1
  Top 0.152: D1.C 85.72,51.75 83.5,53.97 83.5,59.69 74.93,68.26 69.85,68.26 69.22,68.9 69.22,75.25 68.58,75.88 57.15,75.88 56.51,76.52 56.51,82.55 55.88,83.19 36.83,83.19 SV4.1
MOSI  (via drill 0.3)
  Top 0.152: v39.37,11.43 38.42,11.43 9.52,40.32 9.52,81.6 10.48,82.55 26.99,82.55 28.26,81.28 29.53,82.55 30.48,82.55 31.11,81.91 31.11,80.01 SV4.4
  Bottom 0.152: IC9.22 46.35,21.27 44.77,19.69 44.77,12.7 43.5,11.43 v39.37,11.43 | JP10.3 93.98,55.24 84.45,55.24 78.1,61.59 78.1,72.07 75.88,74.3 75.88,78.1 70.48,83.5 41.27,83.5 35.24,77.47 33.66,77.47 SV4.4
N$1
  Top 0.152: U4.12 40.32,39.69 42.54,39.69 U4.11
  Bottom 0.152: U4.5 45.08,32.07 45.08,36.51 42.86,38.73 42.86,39.37 U4.11
N$2  (via drill 0.3)
  Top 0.152: U6.1 15.88,54.29 16.83,53.34 16.83,43.81 18.1,42.55 18.73,42.55 19.68,43.5 19.68,46.04 20.32,46.67 21.59,46.67 22.22,46.04 22.22,42.23 27.62,36.83 27.62,34.92 37.46,25.08 40.64,25.08 42.86,22.86 v73.03,22.86 | v74.93,37.47 v74.93,24.77
  Bottom 0.152: v74.93,24.77 v73.03,22.86 | U3.3 v74.93,37.47
N$3  (via drill 0.3)
  Top 0.152: v51.12,35.56 51.12,35.24 47.94,32.07 U4.6 | v61.59,41.91 72.07,41.91 76.2,37.78 v80.96,37.78
  Bottom 0.152: v51.12,35.56 53.34,35.56 54.93,37.15 60.32,37.15 61.59,38.42 v61.59,41.91 | U3.10 v80.96,37.78
N$4  (via drill 0.3)
  Top 0.152: v53.02,37.78 53.02,39.37 v56.2,42.55 | v73.98,42.55 v62.55,42.55 | v86.36,40.32 86.36,33.66 U3.9
  Bottom 0.152: v53.02,37.78 49.53,37.78 47.94,39.37 U4.9 | v62.55,42.55 v56.2,42.55 | v73.98,42.55 75.56,40.96 85.72,40.96 v86.36,40.32
N$5  (via drill 0.3)
  Top 0.152: R2.1 D4.A D3.A | v48.58,40.96 48.26,40.96 47.94,41.27 44.77,41.27 43.81,40.32 43.81,38.42 39.05,33.66 37.15,33.66 36.19,32.7 v36.19,27.62
  Bottom 0.152: U2.1 47.62,41.91 v48.58,40.96 | v36.19,27.62 32.07,27.62 D3.A
N$6  (via drill 0.3)
  Top 0.152: U3.5 U3.4 v81.6,32.07
  Bottom 0.152: v81.6,32.07 U3.8
N$7  (via drill 0.3)
  Top 0.152: U5.2 59.69,29.84 v73.66,29.84
  Bottom 0.152: v73.66,29.84 74.93,29.84 U3.6
N$8  (via drill 0.3)
  Top 0.152: v68.58,34.92 v66.04,34.92
  Bottom 0.152: v66.04,34.92 U5.4 | v68.58,34.92 69.53,34.92 75.25,40.64 85.41,40.64 86.36,39.69 86.36,38.73 U3.11
N$9  (via drill 0.3)
  Top 0.152: v69.85,33.66 U5.6
  Bottom 0.152: v69.85,33.66 69.85,34.61 75.56,40.32 83.5,40.32 U3.12
N$10
  Bottom 0.152: D4.C 27.62,36.83 26.67,35.88 24.77,35.88 16.83,43.81 16.83,48.89 6.67,59.05 6.67,81.91 10.16,85.41 69.53,85.41 78.74,76.2 COMON.1
N$11  (via drill 0.3)
  Top 0.152: v45.72,30.16 46.67,31.11 46.67,33.02 47.94,34.29 v49.53,34.29 | v60.32,34.29 62.23,36.19 v64.77,36.19 | U5.8 v68.58,37.47
  Bottom 0.152: D3.C 32.07,36.83 36.51,32.38 36.51,30.48 36.83,30.16 v45.72,30.16 | v60.32,34.29 v49.53,34.29 | v64.77,36.19 67.31,36.19 v68.58,37.47
N$12  (via drill 0.3)
  Top 0.152: v65.41,36.83 65.41,34.92 | 65.41,34.92 U5.5 | U6.22 37.46,58.42 v37.46,55.56 | v46.35,46.04 v41.91,50.48 | 65.41,34.92 v61.59,34.92
  Bottom 0.152: U5.10 v65.41,36.83 | v37.46,55.56 41.91,51.12 v41.91,50.48 | v46.35,46.04 46.35,38.42 49.85,34.92 v61.59,34.92
N$13
  Top 0.152: R5.1 114.94,49.53 LED2.A
N$14
  Top 0.152: LED1.A R1.1
OUT0  (via drill 0.3)
  Top 0.152: IC2.2 18.41,49.85 17.14,51.12 v17.14,70.8 | OUT0.1 79.38,73.02 80.64,74.3 80.64,78.42 73.34,85.72 21.27,85.72 v20,84.45
  Bottom 0.152: 17.14,77.47 v17.14,70.8 | SV2.2 17.14,77.47 | v20,84.45 17.14,81.6 17.14,77.47
OUT1  (via drill 0.3)
  Top 0.152: v17.78,60.64 v19.37,59.05
  Bottom 0.152: IC2.5 19.37,51.12 v19.37,59.05 | v17.78,60.64 14.6,63.82 14.6,80.01 SV2.3
OUT2  (via drill 0.3)
  Top 0.152: SV2.4 v25.08,69.53
  Bottom 0.152: IC2.6 28.57,49.85 29.53,50.8 29.53,53.97 26.99,56.52 26.99,60.33 25.08,62.23 v25.08,69.53
OUT3  (via drill 0.3)
  Top 0.152: v24.45,68.58 14.6,78.42 14.6,80.01 SV2.5
  Bottom 0.152: IC2.9 33.66,41.91 28.26,41.91 27.3,42.86 27.3,45.72 22.22,50.8 22.22,59.69 24.45,61.91 v24.45,68.58
OUT4  (via drill 0.3)
  Top 0.152: IC2.12 36.19,47.31 v35.56,46.67 | v25.72,62.23 23.81,62.23 21.91,64.13 21.91,67.31 13.33,75.88 SV2.6
  Bottom 0.152: v35.56,46.67 34.29,46.67 29.84,51.12 29.84,58.1 v25.72,62.23
OUT5  (via drill 0.3)
  Top 0.152: v24.45,59.05 19.68,63.82 19.68,68.9 12.06,76.52 12.06,80.01 SV2.7
  Bottom 0.152: IC2.15 24.45,56.2 v24.45,59.05
OUT6  (via drill 0.3)
  Top 0.152: IC2.16 24.13,50.16 20.64,50.16 19.37,51.44 19.37,58.42 v17.78,60.01
  Bottom 0.152: v17.78,60.01 10.79,66.99 SV2.8
OUT7
  Bottom 0.152: IC2.19 13.33,57.15 11.75,57.15 6.98,61.91 6.98,80.01 SV2.9
Q0  (via drill 0.3)
  Top 0.152: v52.07,53.97 U2.19 | v52.07,58.74 52.07,68.26 51.43,68.9 51.43,72.39 ADAPTER.2
  Bottom 0.152: v52.07,58.74 v52.07,53.97
Q1  (via drill 0.3)
  Top 0.152: v52.7,58.1 52.7,58.74 52.39,59.05 52.39,64.77 56.51,68.9 56.51,72.39 ADAPTER.5
  Bottom 0.152: v52.7,58.1 U2.18
Q2  (via drill 0.3)
  Top 0.152: v53.02,64.77 v53.02,59.05
  Bottom 0.152: U2.17 55.25,56.83 v53.02,59.05 | v53.02,64.77 57.47,64.77 61.59,68.9 61.59,72.39 ADAPTER.6
Q3  (via drill 0.3)
  Top 0.152: v54.61,60.01 53.97,60.64 60.96,67.63 65.72,67.63 66.67,68.58 66.67,72.39 ADAPTER.9
  Bottom 0.152: U2.16 57.78,56.83 v54.61,60.01
Q4  (via drill 0.3)
  Top 0.152: U2.15 66.04,57.78 73.98,57.78 75.56,59.37 v75.56,61.28
  Bottom 0.152: v75.56,61.28 75.56,74.61 70.8,79.38 69.85,79.38 ADAPTER.12
Q5  (via drill 0.3)
  Top 0.152: v59.06,73.02 59.06,66.36 v54.61,61.91
  Bottom 0.152: ADAPTER.15 60.32,80.65 59.06,79.38 v59.06,73.02 | v54.61,61.91 62.86,53.66 U2.14
RH  (via drill 0.3)
  Top 0.152: U6.5 28.57,59.69 33.02,59.69 v33.66,59.05 | v53.66,61.59 53.66,65.41 58.1,69.85 U1.5
  Bottom 0.152: v33.66,59.05 35.24,59.05 37.78,61.59 v53.66,61.59
RL  (via drill 0.3)
  Top 0.152: U6.6 30.48,59.05 v33.02,59.05
  Bottom 0.152: v33.02,59.05 36.83,62.86 44.13,62.86 45.08,63.82 45.08,66.67 45.72,67.31 48.89,67.31 49.74,68.16 U1.2
SCK0  (via drill 0.3)
  Top 0.152: v50.8,9.21 53.02,6.98 53.02,5.08 56.83,1.27 107.95,1.27 112.39,5.71 112.39,28.26 107.63,33.02 v107.63,38.73
  Bottom 0.152: IC8.19 53.97,12.38 v50.8,9.21 | v107.63,38.73 107.31,39.05 107.31,47.31 106.36,48.26 102.23,48.26 100.97,49.53 JP10.2
SCK1  (via drill 0.3)
  Top 0.152: v39.37,10.8 38.42,10.8 6.67,42.55 6.67,81.91 7.94,83.19 v28.89,83.19
  Bottom 0.152: IC8.21 45.72,10.8 v39.37,10.8 | v28.89,83.19 30.48,83.19 SV4.3
VCC
  Top 0.203: U8.30 IC6.28 83.19,28.26 82.55,28.89 82.55,42.55 U3.14 88.26,44.45 C3.1 IC7.20 | U8.32 C4.1 74.29,30.16 66.99,37.47 62.23,37.47 U5.12 | R4.2 90.81,53.34 JP10.5 | 47.62,78.74 47.62,77.79 U1.20 | 47.62,78.74 ADAPTER.20 | C5.1 47.62,77.47 U1.20 | 47.62,78.74 SV4.2 | 47.62,78.74 U1.20 | C2.1 13.97,52.07 | 13.97,52.07 IC2.20 | 13.97,64.77 13.33,64.77 C7.1 | 13.97,64.77 U6.28 | 13.97,64.77 13.97,52.07 | C1.1 U2.20 | 100NF.1 IC8.24 | U4.3 40,32.07 37.78,32.07 U4.2 37.46,31.75 C8.1 IC9.24
  Bottom 0.203: IC6.28 81.91,25.4 U8.32 | 98.42,46.99 94.3,46.99 93.34,47.94 JP10.5 | 98.42,46.99 R5.2 | R4.2 SV3.1 | 98.42,46.99 IC7.20 | U6.28 19.68,68.58 R1.2 19.68,79.06 | SV2.1 18.41,80.33 19.68,79.06 | SV4.2 34.92,79.69 33.66,80.96 33.66,81.6 31.43,83.82 24.45,83.82 19.68,79.06 | 56.51,40.64 57.15,41.27 58.42,41.27 U5.12 | 56.51,40.64 U5.14 | U2.20 53.97,45.72 53.97,43.18 56.51,40.64 | 27.3,38.1 28.57,39.37 34.92,39.37 U4.14 | 27.3,38.1 R2.2 | 100NF.1 37.46,14.92 36.19,16.19 36.19,25.4 C8.1 | U4.14 35.24,39.37 35.24,34.29 37.46,32.07 U4.2 | C1.1 43.81,51.12 40,47.31 40,43.5 37.78,41.27 36.83,41.27 35.24,39.69 U4.14 | IC2.20 22.22,45.72 22.22,43.18 27.3,38.1

### Text on the board
tPlace: Gigatron RAM & IO / Expansion & Video Repeater | Ver. 3 / Rev. 1 | close 1-2 / mode 4lines / open all / mode 3lines | adapter | 1 | 2 | 3,3k | 3 | 100nF | close 2-3 / mode OUT0 | 74377 | IDT720x | 100nF | 100nF | 10k | 74574 | SD-Card | 100nF | 3,3k | GND | 3,3V | SCK | MISO0 | MOSI | /SS0 | 74377 or 74273 | 74113 | 74113 | 7400 | 100nF | 10k | 74244 | A15 | 100nF | GAL2 | 100nF | 100nF | 628128 | GAL1